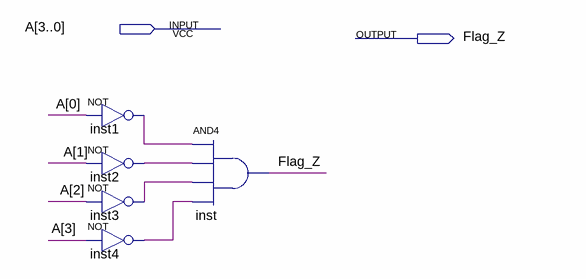
[diagram p0: schematic sheet]
// Quartus schematic Flag_Z.bdf as structural Verilog: 5 symbols, 2 pins
module Flag_Z (
  input  [3:0] A,
  output Flag_Z
);

  wire inst1_out, inst2_out, inst3_out, inst4_out;

  not inst1 (inst1_out, A[0]);
  not inst2 (inst2_out, A[1]);
  not inst3 (inst3_out, A[2]);
  not inst4 (inst4_out, A[3]);
  and inst (Flag_Z, inst1_out, inst2_out, inst3_out, inst4_out);
endmodule
